# Altium project OpenBMS.PrjPcb (part 2 of 3)

## Sheet Measuring.SchDoc: Voltage Measurer
size 420 x 297 mm; ENG_APP_DATE: --/--/--; DSN_APP_DATE: --/--/--; CHK_APP_DATE: --/--/--; Revision: Cell Balancing
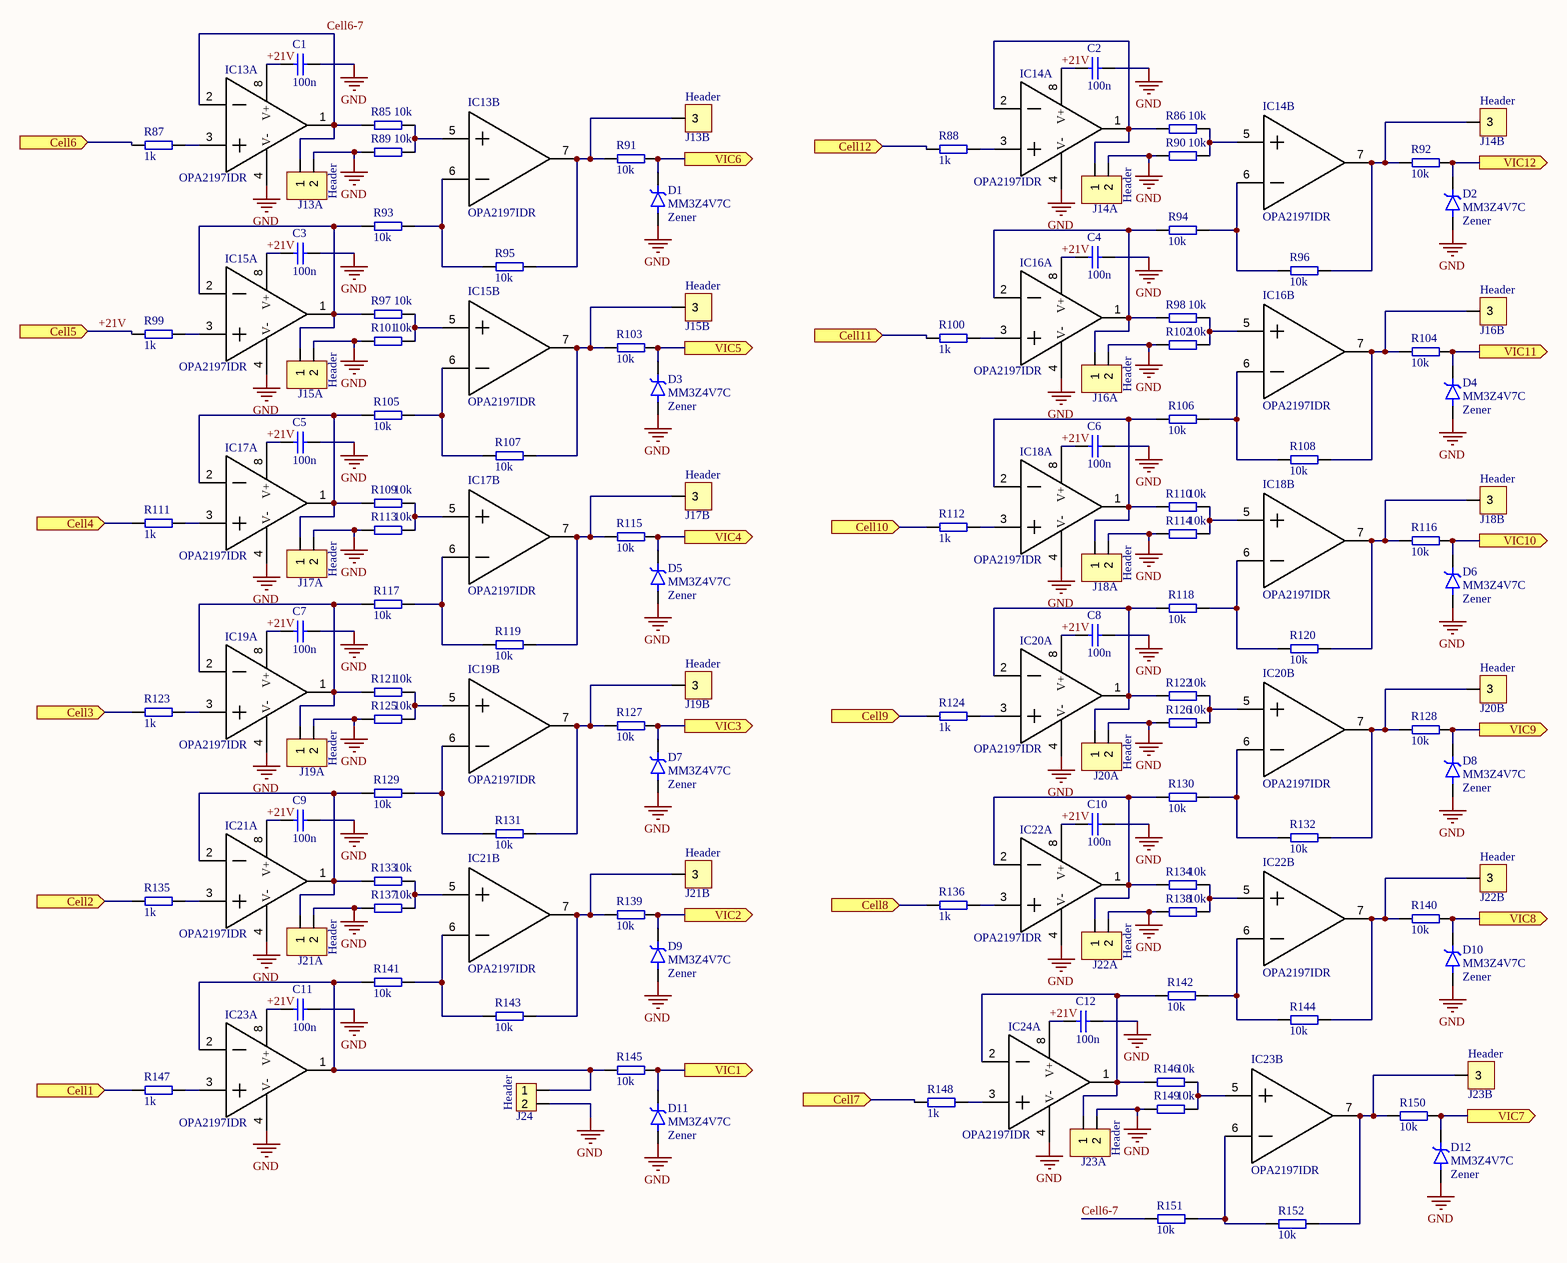
[diagram p2: Measuring.SchDoc]

### Parts
(Parts that share a designator on the sheet are numbered #1, #2 ... from top to bottom, then left to right.)
C1  Name: 100n  [C_0805]  (hidden comment: 100nF_35V)
C2  Name: 100n  [C_0805]  (hidden comment: 100nF_35V)
C3  Name: 100n  [C_0805]  (hidden comment: 100nF_35V)
C4  Name: 100n  [C_0805]  (hidden comment: 100nF_35V)
C5  Name: 100n  [C_0805]  (hidden comment: 100nF_35V)
C6#1  Name: 100n  [C_0805]  (hidden comment: 100nF_35V)
C7#1  Name: 100n  [C_0805]  (hidden comment: 100nF_35V)
C8  Name: 100n  [C_0805]  (hidden comment: 100nF_35V)
C9  Name: 100n  [C_0805]  (hidden comment: 100nF_35V)
C10  Name: 100n  [C_0805]  (hidden comment: 100nF_35V)
C11  Name: 100n  [C_0805]  (hidden comment: 100nF_35V)
C12  Name: 100n  [C_0805]  (hidden comment: 100nF_35V)
D1#1  value MM3Z4V7C  Type: Zener  [SODFL2512X90N]  (hidden comment: MM3Z4V7C_SOD-323F)
D2  value MM3Z4V7C  Type: Zener  [SODFL2512X90N]  (hidden comment: MM3Z4V7C_SOD-323F)
D3  value MM3Z4V7C  Type: Zener  [SODFL2512X90N]  (hidden comment: MM3Z4V7C_SOD-323F)
D4  value MM3Z4V7C  Type: Zener  [SODFL2512X90N]  (hidden comment: MM3Z4V7C_SOD-323F)
D5  value MM3Z4V7C  Type: Zener  [SODFL2512X90N]  (hidden comment: MM3Z4V7C_SOD-323F)
D6  value MM3Z4V7C  Type: Zener  [SODFL2512X90N]  (hidden comment: MM3Z4V7C_SOD-323F)
D7  value MM3Z4V7C  Type: Zener  [SODFL2512X90N]  (hidden comment: MM3Z4V7C_SOD-323F)
D8  value MM3Z4V7C  Type: Zener  [SODFL2512X90N]  (hidden comment: MM3Z4V7C_SOD-323F)
D9  value MM3Z4V7C  Type: Zener  [SODFL2512X90N]  (hidden comment: MM3Z4V7C_SOD-323F)
D10  value MM3Z4V7C  Type: Zener  [SODFL2512X90N]  (hidden comment: MM3Z4V7C_SOD-323F)
D11  value MM3Z4V7C  Type: Zener  [SODFL2512X90N]  (hidden comment: MM3Z4V7C_SOD-323F)
D12  value MM3Z4V7C  Type: Zener  [SODFL2512X90N]  (hidden comment: MM3Z4V7C_SOD-323F)
IC13  Manufacturer_Part_Number: OPA2197IDR  [SOIC8]  (hidden comment: OPA2197IDR_8-SOIC)  (parts A,B of 2)
IC14  Manufacturer_Part_Number: OPA2197IDR  [SOIC8]  (hidden comment: OPA2197IDR_8-SOIC)  (parts A,B of 2)
IC15  Manufacturer_Part_Number: OPA2197IDR  [SOIC8]  (hidden comment: OPA2197IDR_8-SOIC)  (parts A,B of 2)
IC16  Manufacturer_Part_Number: OPA2197IDR  [SOIC8]  (hidden comment: OPA2197IDR_8-SOIC)  (parts A,B of 2)
IC17  Manufacturer_Part_Number: OPA2197IDR  [SOIC8]  (hidden comment: OPA2197IDR_8-SOIC)  (parts A,B of 2)
IC18  Manufacturer_Part_Number: OPA2197IDR  [SOIC8]  (hidden comment: OPA2197IDR_8-SOIC)  (parts A,B of 2)
IC19  Manufacturer_Part_Number: OPA2197IDR  [SOIC8]  (hidden comment: OPA2197IDR_8-SOIC)  (parts A,B of 2)
IC20  Manufacturer_Part_Number: OPA2197IDR  [SOIC8]  (hidden comment: OPA2197IDR_8-SOIC)  (parts A,B of 2)
IC21  Manufacturer_Part_Number: OPA2197IDR  [SOIC8]  (hidden comment: OPA2197IDR_8-SOIC)  (parts A,B of 2)
IC22  Manufacturer_Part_Number: OPA2197IDR  [SOIC8]  (hidden comment: OPA2197IDR_8-SOIC)  (parts A,B of 2)
IC23  Manufacturer_Part_Number: OPA2197IDR  [SOIC8]  (hidden comment: OPA2197IDR_8-SOIC)  (parts A,B of 2)
IC24  Manufacturer_Part_Number: OPA2197IDR  [SOIC8]  (hidden comment: OPA2197IDR_8-SOIC)  (part A of 2)
J13#1  Name: Header  [HDR_1X3_2.54mm-MALE]  (hidden comment: 2.54mm pitch)  (parts A,B of 2)
J14  Name: Header  [HDR_1X3_2.54mm-MALE]  (hidden comment: 2.54mm pitch)  (parts A,B of 2)
J15#1  Name: Header  [HDR_1X3_2.54mm-MALE]  (hidden comment: 2.54mm pitch)  (parts A,B of 2)
J16#1  Name: Header  [HDR_1X3_2.54mm-MALE]  (hidden comment: 2.54mm pitch)  (parts A,B of 2)
J17  Name: Header  [HDR_1X3_2.54mm-MALE]  (hidden comment: 2.54mm pitch)  (parts A,B of 2)
J18  Name: Header  [HDR_1X3_2.54mm-MALE]  (hidden comment: 2.54mm pitch)  (parts A,B of 2)
J19  Name: Header  [HDR_1X3_2.54mm-MALE]  (hidden comment: 2.54mm pitch)  (parts A,B of 2)
J20  Name: Header  [HDR_1X3_2.54mm-MALE]  (hidden comment: 2.54mm pitch)  (parts A,B of 2)
J21  Name: Header  [HDR_1X3_2.54mm-MALE]  (hidden comment: 2.54mm pitch)  (parts A,B of 2)
J22  Name: Header  [HDR_1X3_2.54mm-MALE]  (hidden comment: 2.54mm pitch)  (parts A,B of 2)
J23  Name: Header  [HDR_1X3_2.54mm-MALE]  (hidden comment: 2.54mm pitch)  (parts A,B of 2)
J24  Name: Header  [HDR_1x2_2.54mm-MALE]  (hidden comment: 2.54mm pitch)
R85  Name: 10k  [R_0805]  (hidden comment: 10k_125mW)
R86  Name: 10k  [R_0805]  (hidden comment: 10k_125mW)
R87  Name: 1k  [R_0805]  (hidden comment: 1k_125mW)
R88  Name: 1k  [R_0805]  (hidden comment: 1k_125mW)
R89  Name: 10k  [R_0805]  (hidden comment: 10k_125mW)
R90  Name: 10k  [R_0805]  (hidden comment: 10k_125mW)
R91  Name: 10k  [R_0805]  (hidden comment: 10k_125mW)
R92  Name: 10k  [R_0805]  (hidden comment: 10k_125mW)
R93  Name: 10k  [R_0805]  (hidden comment: 10k_125mW)
R94  Name: 10k  [R_0805]  (hidden comment: 10k_125mW)
R95  Name: 10k  [R_0805]  (hidden comment: 10k_125mW)
R96  Name: 10k  [R_0805]  (hidden comment: 10k_125mW)
R97  Name: 10k  [R_0805]  (hidden comment: 10k_125mW)
R98  Name: 10k  [R_0805]  (hidden comment: 10k_125mW)
R99  Name: 1k  [R_0805]  (hidden comment: 1k_125mW)
R100  Name: 1k  [R_0805]  (hidden comment: 1k_125mW)
R101  Name: 10k  [R_0805]  (hidden comment: 10k_125mW)
R102  Name: 10k  [R_0805]  (hidden comment: 10k_125mW)
R103  Name: 10k  [R_0805]  (hidden comment: 10k_125mW)
R104  Name: 10k  [R_0805]  (hidden comment: 10k_125mW)
R105  Name: 10k  [R_0805]  (hidden comment: 10k_125mW)
R106  Name: 10k  [R_0805]  (hidden comment: 10k_125mW)
R107  Name: 10k  [R_0805]  (hidden comment: 10k_125mW)
R108  Name: 10k  [R_0805]  (hidden comment: 10k_125mW)
R109  Name: 10k  [R_0805]  (hidden comment: 10k_125mW)
R110  Name: 10k  [R_0805]  (hidden comment: 10k_125mW)
R111  Name: 1k  [R_0805]  (hidden comment: 1k_125mW)
R112  Name: 1k  [R_0805]  (hidden comment: 1k_125mW)
R113  Name: 10k  [R_0805]  (hidden comment: 10k_125mW)
R114  Name: 10k  [R_0805]  (hidden comment: 10k_125mW)
R115  Name: 10k  [R_0805]  (hidden comment: 10k_125mW)
R116  Name: 10k  [R_0805]  (hidden comment: 10k_125mW)
R117  Name: 10k  [R_0805]  (hidden comment: 10k_125mW)
R118  Name: 10k  [R_0805]  (hidden comment: 10k_125mW)
R119  Name: 10k  [R_0805]  (hidden comment: 10k_125mW)
R120  Name: 10k  [R_0805]  (hidden comment: 10k_125mW)
R121  Name: 10k  [R_0805]  (hidden comment: 10k_125mW)
R122  Name: 10k  [R_0805]  (hidden comment: 10k_125mW)
R123  Name: 1k  [R_0805]  (hidden comment: 1k_125mW)
R124  Name: 1k  [R_0805]  (hidden comment: 1k_125mW)
R125  Name: 10k  [R_0805]  (hidden comment: 10k_125mW)
R126  Name: 10k  [R_0805]  (hidden comment: 10k_125mW)
R127  Name: 10k  [R_0805]  (hidden comment: 10k_125mW)
R128  Name: 10k  [R_0805]  (hidden comment: 10k_125mW)
R129  Name: 10k  [R_0805]  (hidden comment: 10k_125mW)
R130  Name: 10k  [R_0805]  (hidden comment: 10k_125mW)
R131  Name: 10k  [R_0805]  (hidden comment: 10k_125mW)
R132  Name: 10k  [R_0805]  (hidden comment: 10k_125mW)
R133  Name: 10k  [R_0805]  (hidden comment: 10k_125mW)
R134  Name: 10k  [R_0805]  (hidden comment: 10k_125mW)
R135  Name: 1k  [R_0805]  (hidden comment: 1k_125mW)
R136  Name: 1k  [R_0805]  (hidden comment: 1k_125mW)
R137  Name: 10k  [R_0805]  (hidden comment: 10k_125mW)
R138  Name: 10k  [R_0805]  (hidden comment: 10k_125mW)
R139  Name: 10k  [R_0805]  (hidden comment: 10k_125mW)
R140  Name: 10k  [R_0805]  (hidden comment: 10k_125mW)
R141  Name: 10k  [R_0805]  (hidden comment: 10k_125mW)
R142  Name: 10k  [R_0805]  (hidden comment: 10k_125mW)
R143  Name: 10k  [R_0805]  (hidden comment: 10k_125mW)
R144  Name: 10k  [R_0805]  (hidden comment: 10k_125mW)
R145  Name: 10k  [R_0805]  (hidden comment: 10k_125mW)
R146  Name: 10k  [R_0805]  (hidden comment: 10k_125mW)
R147  Name: 1k  [R_0805]  (hidden comment: 1k_125mW)
R148  Name: 1k  [R_0805]  (hidden comment: 1k_125mW)
R149  Name: 10k  [R_0805]  (hidden comment: 10k_125mW)
R150  Name: 10k  [R_0805]  (hidden comment: 10k_125mW)
R151  Name: 10k  [R_0805]  (hidden comment: 10k_125mW)
R152  Name: 10k  [R_0805]  (hidden comment: 10k_125mW)

### Ports
Cell1 (in), Cell2 (in), Cell3 (in), Cell4 (in), Cell5 (in), Cell6 (in), Cell7 (in), Cell8 (in), Cell9 (in), Cell10 (in), Cell11 (in), Cell12 (in), VIC1 (out), VIC2 (out), VIC3 (out), VIC4 (out), VIC5 (out), VIC6 (out), VIC7 (out), VIC8 (out), VIC9 (out), VIC10 (out), VIC11 (out), VIC12 (out)

### Nets
GND: C1.1 C2.1 C3.1 C4.1 C5.1 C6#1.1 C7#1.1 C8.1 C9.1 C10.1 C11.1 C12.1 D1#1.A D2.A D3.A D4.A D5.A D6.A D7.A D8.A D9.A D10.A D11.A D12.A IC13.4(V-) IC14.4(V-) IC15.4(V-) IC16.4(V-) IC17.4(V-) IC18.4(V-) IC19.4(V-) IC20.4(V-) IC21.4(V-) IC22.4(V-) IC23.4(V-) IC24.4(V-) J13#1.2 J14.2 J15#1.2 J16#1.2 J17.2 J18.2 J19.2 J20.2 J21.2 J22.2 J23.2 J24.2 R89.2 R90.2 R101.2 R102.2 R113.2 R114.2 R125.2 R126.2 R137.2 R138.2 R149.2
+21V: C1.2 C2.2 C3.2 C4.2 C5.2 C6#1.2 C7#1.2 C8.2 C9.2 C10.2 C11.2 C12.2 IC13.8(V+) IC14.8(V+) IC15.8(V+) IC16.8(V+) IC17.8(V+) IC18.8(V+) IC19.8(V+) IC20.8(V+) IC21.8(V+) IC22.8(V+) IC23.8(V+) IC24.8(V+) R99.2 ; port Cell5
Cell6-7: IC13.1(OUT_A) IC13.2(-IN_A) J13#1.1 R85.2 R151.2
NetD1#1_K: D1#1.K R91.1 ; port VIC6
NetD2_K: D2.K R92.1 ; port VIC12
NetD3_K: D3.K R103.1 ; port VIC5
NetD4_K: D4.K R104.1 ; port VIC11
NetD5_K: D5.K R115.1 ; port VIC4
NetD6_K: D6.K R116.1 ; port VIC10
NetD7_K: D7.K R127.1 ; port VIC3
NetD8_K: D8.K R128.1 ; port VIC9
NetD9_K: D9.K R139.1 ; port VIC2
NetD10_K: D10.K R140.1 ; port VIC8
NetD11_K: D11.K R145.1 ; port VIC1
NetD12_K: D12.K R150.1 ; port VIC7
NetIC13_3: IC13.3(+IN_A) R87.1
NetIC13_5: IC13.5(+IN_B) R85.1 R89.1
NetIC13_6: IC13.6(-IN_B) R93.1 R95.2
NetIC13_7: IC13.7(OUT_B) J13#1.3 R91.2 R95.1
NetIC14_1: IC14.1(OUT_A) IC14.2(-IN_A) J14.1 R86.2
NetIC14_3: IC14.3(+IN_A) R88.1
NetIC14_5: IC14.5(+IN_B) R86.1 R90.1
NetIC14_6: IC14.6(-IN_B) R94.1 R96.2
NetIC14_7: IC14.7(OUT_B) J14.3 R92.2 R96.1
NetIC15_1: IC15.1(OUT_A) IC15.2(-IN_A) J15#1.1 R93.2 R97.2
NetIC15_3: IC15.3(+IN_A) R99.1
NetIC15_5: IC15.5(+IN_B) R97.1 R101.1
NetIC15_6: IC15.6(-IN_B) R105.1 R107.2
NetIC15_7: IC15.7(OUT_B) J15#1.3 R103.2 R107.1
NetIC16_1: IC16.1(OUT_A) IC16.2(-IN_A) J16#1.1 R94.2 R98.2
NetIC16_3: IC16.3(+IN_A) R100.1
NetIC16_5: IC16.5(+IN_B) R98.1 R102.1
NetIC16_6: IC16.6(-IN_B) R106.1 R108.2
NetIC16_7: IC16.7(OUT_B) J16#1.3 R104.2 R108.1
NetIC17_1: IC17.1(OUT_A) IC17.2(-IN_A) J17.1 R105.2 R109.2
NetIC17_3: IC17.3(+IN_A) R111.1
NetIC17_5: IC17.5(+IN_B) R109.1 R113.1
NetIC17_6: IC17.6(-IN_B) R117.1 R119.2
NetIC17_7: IC17.7(OUT_B) J17.3 R115.2 R119.1
NetIC18_1: IC18.1(OUT_A) IC18.2(-IN_A) J18.1 R106.2 R110.2
NetIC18_3: IC18.3(+IN_A) R112.1
NetIC18_5: IC18.5(+IN_B) R110.1 R114.1
NetIC18_6: IC18.6(-IN_B) R118.1 R120.2
NetIC18_7: IC18.7(OUT_B) J18.3 R116.2 R120.1
NetIC19_1: IC19.1(OUT_A) IC19.2(-IN_A) J19.1 R117.2 R121.2
NetIC19_3: IC19.3(+IN_A) R123.1
NetIC19_5: IC19.5(+IN_B) R121.1 R125.1
NetIC19_6: IC19.6(-IN_B) R129.1 R131.2
NetIC19_7: IC19.7(OUT_B) J19.3 R127.2 R131.1
NetIC20_1: IC20.1(OUT_A) IC20.2(-IN_A) J20.1 R118.2 R122.2
NetIC20_3: IC20.3(+IN_A) R124.1
NetIC20_5: IC20.5(+IN_B) R122.1 R126.1
NetIC20_6: IC20.6(-IN_B) R130.1 R132.2
NetIC20_7: IC20.7(OUT_B) J20.3 R128.2 R132.1
NetIC21_1: IC21.1(OUT_A) IC21.2(-IN_A) J21.1 R129.2 R133.2
NetIC21_3: IC21.3(+IN_A) R135.1
NetIC21_5: IC21.5(+IN_B) R133.1 R137.1
NetIC21_6: IC21.6(-IN_B) R141.1 R143.2
NetIC21_7: IC21.7(OUT_B) J21.3 R139.2 R143.1
NetIC22_1: IC22.1(OUT_A) IC22.2(-IN_A) J22.1 R130.2 R134.2
NetIC22_3: IC22.3(+IN_A) R136.1
NetIC22_5: IC22.5(+IN_B) R134.1 R138.1
NetIC22_6: IC22.6(-IN_B) R142.1 R144.2
NetIC22_7: IC22.7(OUT_B) J22.3 R140.2 R144.1
NetIC23_1: IC23.1(OUT_A) IC23.2(-IN_A) J24.1 R141.2 R145.2
NetIC23_3: IC23.3(+IN_A) R147.1
NetIC23_5: IC23.5(+IN_B) R146.1 R149.1
NetIC23_6: IC23.6(-IN_B) R151.1 R152.2
NetIC23_7: IC23.7(OUT_B) J23.3 R150.2 R152.1
NetIC24_1: IC24.1(OUT_A) IC24.2(-IN_A) J23.1 R142.2 R146.2
NetIC24_3: IC24.3(+IN_A) R148.1
NetP?_1: R147.2 ; port Cell1
NetP?_2: R136.2 ; port Cell8
NetP?_3: R135.2 ; port Cell2
NetP?_4: R124.2 ; port Cell9
NetP?_5: R123.2 ; port Cell3
NetP?_6: R112.2 ; port Cell10
NetP?_7: R111.2 ; port Cell4
NetP?_8: R100.2 ; port Cell11
NetP?_10: R88.2 ; port Cell12
NetP?_11: R87.2 ; port Cell6
NetP?_13: R148.2 ; port Cell7

### Notes on the sheet
- THIS DOCUMENT AND THE DATA DISCLOSED HEREIN OR
- HEREWITH IS THE PROPERTY OF ALTIUM LIMITED AND MAY
- DWG NO:
- REVISION
- REV:
- DESCRIPTION
- DATE
- APPROVED
- BE FREELY DISTRIBUTED IN WHOLE. NO RIGHTS ARE
- RESERVED OR EXPRESS OR IMPLIED WARANTEE GIVEN.
- ENG:
- APPROVALS
- PROJECT
- DSN:
- CHK:
- REFERENCE DOCUMENTS
- PROJECT REVISION:
- TITLE
- DOCUMENT REVISION:
- DESIGN ITEM:
- BOM:
- FAB DWG:
- PCB DWG:
- ASSY DWG:
- SCALE:
- A3
- SIZE
- CAGE CODE
- FILE NAME
- DWG NO.
- SHEET
- OF
- REV

### Library data of the parts
C1-C5 C6#1 C7#1 C8-C12 = C_100nF_0805: Capacitor [SMD]; Manufacturer: Murata; Manufacturer Part Number: GCJ21BL81H104KA01L; Capacitance: 100nF; Tolerance: 10%; Voltage Rating: 50V; ComponentLink1Description: DATASHEET; ComponentLink1URL: https://hr.mouser.com/datasheet/2/281/GCJ21BL81H104KA01_01-1963909.pdf; ComponentLink2Description: BUY; ComponentLink2URL: https://hr.mouser.com/ProductDetail/Murata-Electronics/GCJ21BL81H104KA01L?qs=QzBtWTOodeX5ICEuC%252Bh33g%3D%3D; Supplier 1: Mouser; Supplier Part Number 1: 81-GCJ21BL81H104KA1L; Case Code (Imperial): 0805; Case Code (Metric): 2012; Case/Package: 0805; Features: Soft Termination; Max Operating Temperature: 150°C; Min Operating Temperature: -55°C; Mount: Surface Mount; Packaging: Tape and Reel; Ratings: AEC-Q200; RoHS Compliant: Yes; Supplier Packaging 1: Tape & Reel; Supplier Unit Price 1: $0.30; Supplier Location 1: US
D1#1 D2-D12 = MM3Z4V7C_SOD-323F: Zener Single Diode, 4.7 V, 200 mW [SMD]; Manufacturer: ON Semiconductor / Fairchild; MP: 1N4148WS; MF: ON Semiconductor; Forward Voltage: 1V; Impedance: 75R; Max Power Dissipation: 200mW; Max Reverse Current: 2.7uA; Test Current: 5mA; Tolerance: 5%; Working Voltage: 4.7V; Price: None; SnapEDA_Link: https://www.snapeda.com/parts/1N4148WS/ON%20Semiconductor/view-part/2747266/?ref=snap; Availability: Good; Package: SOD-323FL-2 ON Semiconductor; ComponentLink1Description: DATASHEET; ComponentLink1URL: https://hr.mouser.com/datasheet/2/308/1/MM3Z9V1C_D-2315854.pdf; ComponentLink2Description: BUY; ComponentLink2URL: https://hr.mouser.com/ProductDetail/onsemi-Fairchild/MM3Z4V7C?qs=sGAEpiMZZMtdo5lL%2F%252BX2BwKAOpX0rFyD; Check_prices: https://www.snapeda.com/parts/1N4148WS/ON%20Semiconductor/view-part/2747266/?ref=eda; Purchase-URL: https://pricing.snapeda.com/search/part/1N4148WS/?ref=eda; Supplier 1: Mouser; Supplier Part Number 1: 512-MM3Z4V7C; Element Configuration: Single; Height: 1mm; Lead Free: Lead Free; Length: 1.3mm; Max Operating Temperature: 150°C; Max Reverse Leakage Current: 2.7uA; Min Operating Temperature: -65°C; Mount: Surface Mount; Number of Pins: 2; Package Quantity: 1; Packaging: Tape and Reel; Power Dissipation: 200mW; Radiation Hardening: No; RoHS Compliant: Yes; Voltage Tolerance: 5%; Weight: 0.0276g; Width: 1.7mm; Zener Voltage: 4.7V; Supplier Packaging 1: Tape & Reel; Supplier Unit Price 1: $0.24; Supplier Location 1: US; Manufacturer Part Number: MM3Z4V7C; Case/Package: SOD−323FL
IC13-IC24 = OPA2197IDR_8-SOIC: Dual OP AMP [TH]; Manufacturer_Name: Texas Instruments; Bandwidth: 10MHz; Input Bias Current: 5pA; Input Offset Voltage (Vos): 250uV; Number of Amplifiers: 2; Operating Supply Current: 1mA; Output Current per Channel: 65mA; Slew Rate: 20V/µs; Datasheet Link: https://componentsearchengine.com/Datasheets/2/OPA2197IDR.pdf; Height: 1.75mm; Mouser Part Number: 595-OPA2197IDR; Mouser Price/Stock: https://www.mouser.com/Search/Refine.aspx?Keyword=595-OPA2197IDR; ComponentLink1Description: DATASHEET; ComponentLink1URL: https://www.ti.com/lit/ds/symlink/opa2197.pdf?HQS=dis-mous-null-mousermode-dsf-pf-null-wwe&ts=1646121857740&ref_url=https%253A%252F%252Fwww.mouser.de%252F; ComponentLink2Description: BUY; ComponentLink2URL: https://hr.mouser.com/ProductDetail/Texas-Instruments/OPA2197IDR?qs=LuYMPh7GGMTV7Fo%252BZRgbTw%3D%3D; Supplier 1: Mouser; Supplier Part Number 1: 595-OPA2197IDR; Case/Package: SOIC-8; Gain Bandwidth Product: 10MHz; Lead Free: Lead Free; Max Operating Temperature: 125°C; Min Operating Temperature: -40°C; Mount: Surface Mount; Number of Channels: 2; Number of Circuits: 2; Number of Pins: 8; Packaging: Cut Tape; REACH SVHC: No SVHC; RoHS Compliant: Yes; Supplier Packaging 1: Tape & Reel; Supplier Unit Price 1: $2.72; Supplier Location 1: US; Manufacturer: Texas Instruments; Manufacturer Part Number: OPA2197IDR
J13#1 J14 J15#1 J16#1 J17-J23 = Header 1x3AB: Header, 3-Pin [TH]; Manufacturer: Molex; Connector Type: Male Pin; Current Rating: 4A; Gender: Male; Glow Wire Compliant: Non-compliant; Number of Circuits: 15; Pitch: 0.1inch; Voltage Rating: 250V; LatestRevisionDate: 17-Jul-2002; LatestRevisionNote: Re-released for DXP Platform.; Publisher: Altium Limited; ComponentLink1Description: DATASHEET; ComponentLink1URL: https://hr.mouser.com/datasheet/2/276/0022284150_PCB_HEADERS-159054.pdf; ComponentLink2Description: BUY; ComponentLink2URL: https://hr.mouser.com/ProductDetail/Molex/22-28-4150?qs=M5Ic86%252BuP8aClMFgmZrq7g%3D%3D; Supplier 1: Mouser; Supplier Part Number 1: 538-22-28-4150; Color: Black; Contact Material: Brass; Contact Mating Length: 0.24inch; Contact Plating: Tin; Contact Type: Male Pin; Flammability Rating: UL94 V-0; Height: 2.29mm; Housing Color: Black; Housing Material: Thermoplastic; Lead Free: Contains Lead; Length: 38.1mm; Mount: Through Hole; Number of Contacts: 15; Number of Positions: 15; Number of Rows: 1; Orientation: Vertical; Package Quantity: 1; Packaging: Bulk; RoHS Compliant: Yes; Series: KK® 42375; Termination: Solder; Voltage Rating (DC): 250V; Width: 2.49mm; Supplier Packaging 1: Bulk; Supplier Unit Price 1: $0.57; Supplier Location 1: US; Manufacturer Part Number: 22-28-4150
J24 = Header 1x2: Header, 2-Pin [TH]; Manufacturer: Molex; Current Rating: 4A; Gender: Male; Glow Wire Compliant: Non-compliant; Number of Circuits: 15; Pitch: 0.1inch; Voltage Rating: 250V; Connector Type: Male Pin; LatestRevisionDate: 17-Jul-2002; LatestRevisionNote: Re-released for DXP Platform.; Publisher: Altium Limited; ComponentLink1Description: DATASHEET; ComponentLink1URL: https://hr.mouser.com/datasheet/2/276/0022284150_PCB_HEADERS-159054.pdf; ComponentLink2Description: BUY; ComponentLink2URL: https://hr.mouser.com/ProductDetail/Molex/22-28-4150?qs=M5Ic86%252BuP8aClMFgmZrq7g%3D%3D; Supplier 1: Mouser; Supplier Part Number 1: 538-22-28-4150; Color: Black; Contact Material: Brass; Contact Mating Length: 0.24inch; Contact Plating: Tin; Contact Type: Male Pin; Flammability Rating: UL94 V-0; Height: 2.29mm; Housing Color: Black; Housing Material: Thermoplastic; Lead Free: Contains Lead; Length: 38.1mm; Mount: Through Hole; Number of Contacts: 15; Number of Positions: 15; Number of Rows: 1; Orientation: Vertical; Package Quantity: 1; Packaging: Bulk; RoHS Compliant: Yes; Series: KK® 42375; Termination: Solder; Voltage Rating (DC): 250V; Width: 2.49mm; Supplier Packaging 1: Bulk; Supplier Unit Price 1: $0.57; Supplier Location 1: US; Manufacturer Part Number: 22-28-4150
R85 R86 R89-R98 R101-R110 R113-R122 R125-R134 R137-R146 R149-R152 = R_10k_0805: Resistor [SMD]; Manufacturer: Vishay; Manufacturer Part Number: CRCW080510K0FKEAC; Power Rating: 125mW; Resistance: 10000R; Tolerance: 1%; ComponentLink1Description: DATASHEET; ComponentLink1URL: https://hr.mouser.com/datasheet/2/427/crcwce3-1762584.pdf; ComponentLink2Description: BUY; ComponentLink2URL: https://hr.mouser.com/ProductDetail/Vishay-Dale/CRCW080510K0FKEAC?qs=E3Y5ESvWgWORadmUijPtxQ%3D%3D; Supplier 1: Mouser; Supplier Part Number 1: 71-CRCW080510K0FKEAC; Case/Package: 0805; Lead Free: Lead Free; RoHS Compliant: Yes; Supplier Packaging 1: Tape & Reel; Supplier Unit Price 1: $0.10; Supplier Location 1: US
R87 R88 R99 R100 R111 R112 R123 R124 R135 R136 R147 R148 = R_1k_0805: Resistor [SMD]; Manufacturer: Vishay; Manufacturer Part Number: CRCW08051K00FKEAC; Max Power Dissipation: 125mW; Resistance: 1kR; Temperature Coefficient: 100ppm/°C; Tolerance: 1%; Voltage Rating: 150V; ComponentLink1Description: DATASHEET; ComponentLink1URL: https://www.mouser.com/datasheet/2/427/crcwce3-1762584.pdf; ComponentLink2Description: BUY; ComponentLink2URL: https://www.mouser.com/ProductDetail/Vishay-Dale/CRCW08051K00FKEAC?qs=CZ6xfwOSLTXmQIgaYvN%2FBA%3D%3D; Supplier 1: Mouser; Supplier Part Number 1: 71-CRCW08051K00FKEAC; Case Code (Imperial): 0805; Case Code (Metric): 2012; Case/Package: 0805; Contact Plating: Tin; Features: Automotive AEC-Q200,Anti-Sulfur; Height: 0.02inch; Length: 2mm; Max Operating Temperature: 155°C; Min Operating Temperature: -55°C; Number of Terminations: 2; Package Quantity: 5000; Packaging: Tape and Reel; Power Rating: 125mW; Radiation Hardening: No; Resistor Type: Thick Film; RoHS Compliant: Yes; Series: RCA; Termination: Wraparound; Width: 0.049inch; Supplier Packaging 1: Tape & Reel; Supplier Unit Price 1: $0.12; Supplier Location 1: US; Lead Free: Lead Free; Mount: Surface Mount

## Sheet Microcontroller.SchDoc: MCU & Power management
size 420 x 297 mm; ENG_APP_DATE: --/--/--; DSN_APP_DATE: --/--/--; CHK_APP_DATE: --/--/--
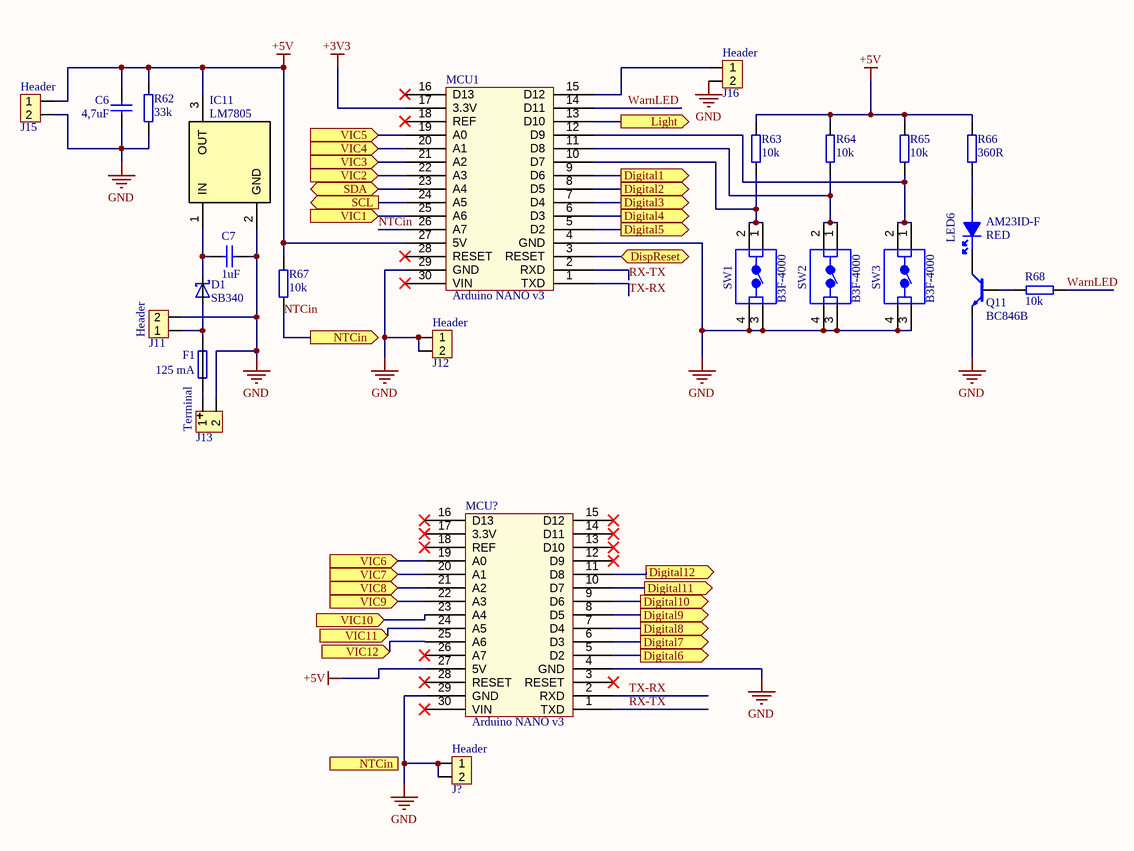
[diagram p3: Microcontroller.SchDoc]

### Parts
(Parts that share a designator on the sheet are numbered #1, #2 ... from top to bottom, then left to right.)
C6#2  Name: 4,7uF  [C_0805]  (hidden comment: 4,7uF_35V)
C7#2  Name: 1uF  [C_0805]  (hidden comment: 1uF_35V)
D1#2  Name: SB340  [DO-201AD]  (hidden comment: SB340_DO-201AD)
F1  value 125 mA  [FUSE_5x20]  (hidden comment: PTF0078P)
IC11#2  Name: LM7805  [TO220]  (hidden comment: LM7805_TO220)
J11#2  Name: Header  [HDR_1x2_2.54mm-MALE]  (hidden comment: 2.54mm pitch)
J12#2  Name: Header  [HDR_1x2_2.54mm-MALE]  (hidden comment: 2.54mm pitch)
J13#2  Name: Terminal  [TERMINAL_90_5MM]  (hidden comment: 5mm pitch)
J15#2  Name: Header  [HDR_1x2_2.54mm-MALE]  (hidden comment: 2.54mm pitch)
J16#2  Name: Header  [HDR_1x2_2.54mm-MALE]  (hidden comment: 2.54mm pitch)
J?  Name: Header  [HDR_1x2_2.54mm-MALE]  (hidden comment: 2.54mm pitch)
LED6#2  Name: RED  Manufacturer Part Number: AM23ID-F  [LED_SOT23]  (hidden comment: LED_SOT23)
MCU1  Name: Arduino NANO v3  [Arduino_Nano_V3.0]  (hidden comment: Arduino NANO v 3.0)
MCU?  Name: Arduino NANO v3  [Arduino_Nano_V3.0]  (hidden comment: Arduino NANO v 3.0)
Q11#2  Name: BC846B  [NPN_BJT_SOT23]  (hidden comment: BC846B_SOT23)
R62#2  Name: 33k  [R_0805]  (hidden comment: 33k_125mW)
R63#2  Name: 10k  [R_0805]  (hidden comment: 10k_125mW)
R64#2  Name: 10k  [R_0805]  (hidden comment: 10k_125mW)
R65#2  Name: 10k  [R_0805]  (hidden comment: 10k_125mW)
R66#2  Name: 360R  [R_0805]  (hidden comment: 360R_125mW)
R67#2  Name: 10k  [R_0805]  (hidden comment: 10k_125mW)
R68#2  Name: 10k  [R_0805]  (hidden comment: 10k_125mW)
SW1  B3F-4000  [PUSH_BUTTON]
SW2  B3F-4000  [PUSH_BUTTON]
SW3  B3F-4000  [PUSH_BUTTON]

### Ports
Digital1 (out), Digital2 (out), Digital3 (out), Digital4 (out), Digital5 (out), Digital6 (out), Digital7 (out), Digital8 (out), Digital9 (out), Digital10 (out), Digital11 (out), Digital12 (out), DispReset (bidir), Light (out), NTCin (out), SCL (out), SDA (bidir), VIC1 (in), VIC2 (in), VIC3 (in), VIC4 (in), VIC5 (in), VIC6 (in), VIC7 (in), VIC8 (in), VIC9 (in), VIC10 (in), VIC11 (in), VIC12 (in)

### Nets
+3V3: MCU1.17(3.3V)
+5V: C6#2.2 IC11#2.3(OUT) J15#2.1 MCU1.27(5V) MCU?.27(5V) R62#2.1 R63#2.2 R64#2.2 R65#2.2 R66#2.1 R67#2.1
GND: C6#2.1 C7#2.2 IC11#2.2(GND) J11#2.2 J12#2.1 J12#2.2 J13#2.2 J15#2.2 J16#2.2 J?.1 J?.2 MCU1.4(GND) MCU1.29(GND) MCU?.4(GND) MCU?.29(GND) Q11#2.3(E) R62#2.2 SW1.3 SW1.4 SW2.3 SW2.4 SW3.3 SW3.4
NTCin: MCU1.26(A7) R67#2.2 ; port NTCin
RX-TX: MCU1.2(RXD) MCU?.1(TXD)
TX-RX: MCU1.1(TXD) MCU?.2(RXD)
WarnLED: MCU1.14(D11) R68#2.1
NetC7#2_1: C7#2.1 D1#2.2 IC11#2.1(IN)
NetD1#2_1: D1#2.1 F1.2 J11#2.1
NetDS1_1: MCU1.3(RESET) ; port DispReset
NetDS1_2: MCU1.24(A5) ; port SCL
NetDS1_3: MCU1.23(A4) ; port SDA
NetF1_1: F1.1 J13#2.1
NetJ16#2_1: J16#2.1 MCU1.15(D12)
NetLED6#2_1: LED6#2.1(A) R66#2.2
NetLED6#2_3: LED6#2.3(K) Q11#2.1(C)
NetMCU1_5: MCU1.5(D2) ; port Digital5
NetMCU1_6: MCU1.6(D3) ; port Digital4
NetMCU1_7: MCU1.7(D4) ; port Digital3
NetMCU1_8: MCU1.8(D5) ; port Digital2
NetMCU1_9: MCU1.9(D6) ; port Digital1
NetMCU1_10: MCU1.10(D7) R63#2.1 SW1.1 SW1.2
NetMCU1_11: MCU1.11(D8) R64#2.1 SW2.1 SW2.2
NetMCU1_12: MCU1.12(D9) R65#2.1 SW3.1 SW3.2
NetMCU1_13: MCU1.13(D10) ; port Light
NetMCU1_19: MCU1.19(A0) ; port VIC5
NetMCU1_20: MCU1.20(A1) ; port VIC4
NetMCU1_21: MCU1.21(A2) ; port VIC3
NetMCU1_22: MCU1.22(A3) ; port VIC2
NetMCU1_25: MCU1.25(A6) ; port VIC1
NetMCU?_5: MCU?.5(D2) ; port Digital6
NetMCU?_6: MCU?.6(D3) ; port Digital7
NetMCU?_7: MCU?.7(D4) ; port Digital8
NetMCU?_8: MCU?.8(D5) ; port Digital9
NetMCU?_9: MCU?.9(D6) ; port Digital10
NetMCU?_10: MCU?.10(D7) ; port Digital11
NetMCU?_11: MCU?.11(D8) ; port Digital12
NetMCU?_19: MCU?.19(A0) ; port VIC6
NetMCU?_20: MCU?.20(A1) ; port VIC7
NetMCU?_21: MCU?.21(A2) ; port VIC8
NetMCU?_22: MCU?.22(A3) ; port VIC9
NetMCU?_23: MCU?.23(A4) ; port VIC10
NetMCU?_24: MCU?.24(A5) ; port VIC11
NetMCU?_25: MCU?.25(A6) ; port VIC12
NetQ11#2_2: Q11#2.2(B) R68#2.2

Not connected (* = marked no-connect by the designer): MCU1 16(D13)* 18(REF)* 28(RESET)* 30(VIN)*; MCU? 3(RESET)* 12(D9)* 13(D10)* 14(D11)* 15(D12)* 16(D13)* 17(3.3V)* 18(REF)* 26(A7)* 28(RESET)* 30(VIN)*

### Notes on the sheet
- THIS DOCUMENT AND THE DATA DISCLOSED HEREIN OR
- HEREWITH IS THE PROPERTY OF ALTIUM LIMITED AND MAY
- DWG NO:
- REVISION
- REV:
- DESCRIPTION
- DATE
- APPROVED
- BE FREELY DISTRIBUTED IN WHOLE. NO RIGHTS ARE
- RESERVED OR EXPRESS OR IMPLIED WARANTEE GIVEN.
- ENG:
- APPROVALS
- PROJECT
- DSN:
- CHK:
- REFERENCE DOCUMENTS
- PROJECT REVISION:
- TITLE
- DOCUMENT REVISION:
- DESIGN ITEM:
- BOM:
- FAB DWG:
- PCB DWG:
- ASSY DWG:
- SCALE:
- A3
- SIZE
- CAGE CODE
- FILE NAME
- DWG NO.
- SHEET
- OF
- REV

### Library data of the parts
C6#2 = C_4,7uF_0805: Capacitor [SMD]; Manufacturer: Murata; Manufacturer Part Number: GRM21BR61H475KE51L; Capacitance: 4.7uF; Dielectric: X5R; Material: Ceramic; Tolerance: 10%; Voltage Rating: 50V; ComponentLink1Description: DATASHEET; ComponentLink1URL: https://hr.mouser.com/datasheet/2/281/1/GRM21BR61H475KE51_01A-1987025.pdf; ComponentLink2Description: BUY; ComponentLink2URL: https://hr.mouser.com/ProductDetail/Murata-Electronics/GRM21BR61H475KE51L?qs=eeBpzGFlv%252B%252BOtLzDC1PY6Q%3D%3D; Supplier 1: Mouser; Supplier Part Number 1: 81-GRM21BR61H475KE1L; Case Code (Imperial): 0805; Case Code (Metric): 2012; Case/Package: 0805; Depth: 1.25mm; Height: 1.25mm; Lead Free: Lead Free; Length: 2mm; Max Operating Temperature: 85°C; Min Operating Temperature: -55°C; Mount: Surface Mount; Packaging: Tape and Reel; REACH SVHC: No SVHC; RoHS Compliant: Yes; Thickness: 0.055inch; Voltage Rating (DC): 50V; Width: 0.049inch; Supplier Packaging 1: Tape & Reel; Supplier Unit Price 1: $0.35; Supplier Location 1: US
C7#2 = C_1uF_0805: Capacitor [SMD]; Manufacturer: Murata; Manufacturer Part Number: GCJ21BR71H105KA01L; Dielectric: X7R; Tolerance: 10%; Voltage Rating: 50V; ComponentLink1Description: DATASHEET; ComponentLink1URL: https://hr.mouser.com/datasheet/2/281/GCJ21BR71H105KA01_01-1963894.pdf; ComponentLink2Description: BUY; ComponentLink2URL: https://hr.mouser.com/ProductDetail/Murata-Electronics/GCJ21BR71H105KA01L?qs=hNud%2FORuBR3CJcLH9kX5%252Bw%3D%3D; Supplier 1: Mouser; Supplier Part Number 1: 81-GCJ21BR71H105KA1L; Capacitance: 1uF; Case Code (Imperial): 0805; Case Code (Metric): 2012; Case/Package: 0805; Features: Soft Termination; Height: 1.25mm; Lead Free: Lead Free; Length: 0.079inch; Max Operating Temperature: 125°C; Min Operating Temperature: -55°C; Mount: Surface Mount; Package Quantity: 3000; Packaging: Tape and Reel; Ratings: AEC-Q200; RoHS Compliant: Yes; Termination: SMD/SMT; Thickness: 0.057inch; Voltage Rating (DC): 50V; Weight: 0.000335oz; Width: 0.049inch; Supplier Packaging 1: Tape & Reel; Supplier Unit Price 1: $0.32; Supplier Location 1: US
D1#2 = SB340_DO-201AD: Diode Schottky 40V 3A [TH]; Manufacturer: Vishay Semiconductors; Manufacturer Part Number: SB340-E3/54; MP: 1N5822; Value: SB340; MF: ON Semiconductor; Element Configuration: Single; Forward Voltage: 490mV; Max Forward Surge Current (Ifsm): 120A; Max Reverse Current: 500uA; Package: DO-201AD-201 Panjit; SnapEDA_Link: https://www.snapeda.com/parts/1N5822/ON%20Semiconductor/view-part/1356736/?ref=snap; Price: None; Availability: Unavailable; ComponentLink1Description: DATASHEET; ComponentLink1URL: https://hr.mouser.com/datasheet/2/427/VISH_S_A0001809294_1-2567748.pdf; ComponentLink2Description: BUY; ComponentLink2URL: https://hr.mouser.com/ProductDetail/Vishay-General-Semiconductor/SB340-E3-54?qs=u91jd7aysvMt27Sml4hAKw%3D%3D; Supplier 1: Mouser; Supplier Part Number 1: 625-SB340-E3/54; Average Rectified Current: 3A; Case/Package: DO-201AD; Forward Current: 3A; Height: 5.8mm; Lead Free: Lead Free; Length: 10mm; Max Operating Temperature: 125°C; Max Repetitive Reverse Voltage (Vrrm): 40V; Max Reverse Leakage Current: 500uA; Max Reverse Voltage (DC): 40V; Max Surge Current: 120A; Min Operating Temperature: -65°C; Mount: Through Hole; Number of Pins: 2; Package Quantity: 1400; Packaging: Tape and Reel; Peak Non-Repetitive Surge Current: 120A; Radiation Hardening: No; REACH SVHC: Unknown; RoHS Compliant: Yes; Series: -; Width: 5.8mm; Supplier Packaging 1: Tape & Reel; Supplier Unit Price 1: $0.46; Supplier Location 1: US
F1 = PTF0078P: Fuse holder [TH]; Manufacturer: Littelfuse; Manufacturer Part Number: 0PTF0078P; MP: 4527; MF: Keystone; Name: Fuse 1A; Number of Circuits: 1; Price: None; Availability: Unavailable; SnapEDA_Link: https://www.snapeda.com/parts/4527/Keystone%20Electronics/view-part/475964/?ref=snap; Package: None; ComponentLink1Description: DATASHEET; ComponentLink1URL: https://hr.mouser.com/datasheet/2/240/Littelfuse-2891966.pdf; ComponentLink2Description: BUY; ComponentLink2URL: https://hr.mouser.com/ProductDetail/Littelfuse/0PTF0078P?qs=Co4VkB5J4%2Fsczy6gG8s%2FsA%3D%3D; Supplier 1: Mouser; Supplier Part Number 1: 576-0PTF0078P; Mount: PCB; Package Quantity: 2000; Packaging: Bulk; Termination: PC Pin; Supplier Packaging 1: Bulk; Supplier Unit Price 1: $0.59; Supplier Location 1: US
IC11#2 = LM7805_TO220: Linear Voltage Regulator 5V [TH] with thermal pad mounted to Fischer elektronik SK09 - 20mm heatsink with a screw and nut; Manufacturer: STMicroelectronics; Manufacturer Part Number: L7805C-V; MP: LM7805CT; MF: ON Semiconductor; Dropout Voltage: 2V; Max Input Voltage: 35V; Max Output Current: 1.5A; Min Input Voltage: 7V; Number of Outputs: 1; Output Configuration: Positive; Output Type: Fixed; Power Supply Rejection Ratio (PSRR): 62dB; Quiescent Current: 8mA; Tolerance: 5%; SnapEDA_Link: https://www.snapeda.com/parts/LM7805CT/ON%20Semiconductor/view-part/546231/?ref=snap; Price: None; Package: TO-220 ON Semiconductor; Value: *; Availability: Unavailable; ComponentLink1Description: Rregulator_DATASHEET; ComponentLink1URL: https://hr.mouser.com/datasheet/2/389/cd00000444-1795274.pdf; ComponentLink2Description: Regulator_BUY; ComponentLink2URL: https://hr.mouser.com/ProductDetail/STMicroelectronics/L7805CV?qs=9NrABl3fj%2FqplZAHiYUxWg%3D%3D; Supplier 1: Mouser; Supplier Part Number 1: 511-L7805CV; Case/Package: TO-220; Contact Plating: Gold; Height: 9.15mm; Lead Free: Lead Free; Length: 10.4mm; Max Operating Temperature: 125°C; Min Operating Temperature: 0°C; Min Output Voltage: 5V; Mount: Through Hole; Nominal Output Voltage: 5V; Number of Pins: 3; Number of Regulators: 1; Output Current: 1.5A; Output Voltage: 5V; Package Quantity: 1000; Packaging: Rail/Tube; Polarity: Positive; Radiation Hardening: No; REACH SVHC: No SVHC; RoHS Compliant: Yes; Series: -; Weight: 0.08113oz; Width: 4.6mm; Supplier Packaging 1: Tube; Supplier Unit Price 1: $0.63; Supplier Location 1: US; ComponentLink3Description: Heatsink_OFFICIAL PAGE; ComponentLink3URL: https://www.fischerelektronik.de/web_fischer/en_GB/heatsinks/A01/Standard%20extruded%20heatsinks/PG/SK09/search.xhtml; ComponentLink4Description: Heatsink_BUY; ComponentLink4URL: https://www.tme.eu/en/details/sk09-20sa220/heatsinks/fischer-elektronik/sk-09-20-sa-to-220/
J11#2 J12#2 J15#2 J16#2 J? = Header 1x2: as J24 on sheet Measuring; LatestRevisionDate: 17-Jul-2002; LatestRevisionNote: Re-released for DXP Platform.; Publisher: Altium Limited; ComponentLink1Description: DATASHEET; ComponentLink1URL: https://hr.mouser.com/datasheet/2/276/0022284150_PCB_HEADERS-159054.pdf; ComponentLink2Description: BUY; ComponentLink2URL: https://hr.mouser.com/ProductDetail/Molex/22-28-4150?qs=M5Ic86%252BuP8aClMFgmZrq7g%3D%3D; Supplier 1: Mouser; Supplier Part Number 1: 538-22-28-4150; Color: Black; Contact Material: Brass; Contact Mating Length: 0.24inch; Contact Plating: Tin; Contact Type: Male Pin; Flammability Rating: UL94 V-0; Height: 2.29mm; Housing Color: Black; Housing Material: Thermoplastic; Lead Free: Contains Lead; Length: 38.1mm; Mount: Through Hole; Number of Contacts: 15; Number of Positions: 15; Number of Rows: 1; Orientation: Vertical; Package Quantity: 1; Packaging: Bulk; RoHS Compliant: Yes; Series: KK® 42375; Termination: Solder; Voltage Rating (DC): 250V; Width: 2.49mm; Supplier Packaging 1: Bulk; Supplier Unit Price 1: $0.57; Supplier Location 1: US; Manufacturer Part Number: 22-28-4150
J13#2 = Terminal 1x2: PCB connector, 2-Pin [TH]; Manufacturer: CUI Devices; Manufacturer Part Number: TB006-508-02BE; LatestRevisionDate: 17-Jul-2002; LatestRevisionNote: Re-released for DXP Platform.; Publisher: Altium Limited; ComponentLink1Description: DATASHEET; ComponentLink1URL: https://hr.mouser.com/datasheet/2/670/tb006_508-2306877.pdf; ComponentLink2Description: BUY; ComponentLink2URL: https://hr.mouser.com/ProductDetail/CUI-Devices/TB006-508-02BE?qs=vLWxofP3U2wEdOVV%2FaT04w%3D%3D; Supplier 1: Mouser; Supplier Part Number 1: 490-TB006-508-02BE; Supplier Unit Price 1: $0.85; Supplier Location 1: US
LED6#2 = LED_SOT23: Red LED [SMD]; Manufacturer: Kingbright; Dominant Wavelength: 617nm; Forward Current: 20mA; Forward Voltage: 2V; Lens Style: Diffused,Tinted; Lens Transparency: Diffused; Luminous Intensity: 7mcd; Power Rating: 75mW; Viewing Angle: 140°; Wavelength: 625nm; ComponentLink1Description: DATASHEET; ComponentLink1URL: https://hr.mouser.com/datasheet/2/216/AM23ID-F-33364.pdf; ComponentLink2Description: BUY; ComponentLink2URL: https://hr.mouser.com/ProductDetail/Kingbright/AM23ID-F?qs=y3UkhjaxUTbVf8YFp%2FiekA%3D%3D; Supplier 1: Mouser; Supplier Part Number 1: 604-AM23ID-F; Case/Package: SOT-23; Color: Red; Height: 1.2mm; Illumination Color: Red; Lead Free: Lead Free; Length: 3mm; Lens Color: Red; Max Operating Temperature: 85°C; Min Operating Temperature: -40°C; Mount: Surface Mount; Package Quantity: 2000; Packaging: Tape and Reel; RoHS Compliant: Yes; Series: -; Test Current: 20mA; Width: 1.3mm; Supplier Packaging 1: Tape & Reel; Supplier Unit Price 1: $0.50; Supplier Location 1: US
MCU1 MCU? = Arduino NANO v 3.0: Microcontroller [TH]; Manufacturer Part Number: A000005; Core Architecture: AVR; Data Bus Width: 8b; Evaluation Kit: Yes; Number of Bits: 8; Operating Supply Voltage: 20V; Interface: I2C,SPI,USB; ComponentLink1Description: OFFICIAL PAGE; ComponentLink1URL: https://store.arduino.cc/arduino-nano; Height: 0.25inch; Length: 7inch; Package Quantity: 1; Packaging: Bulk; REACH SVHC: No SVHC; Weight: 0.02lb; Width: 5inch; Manufacturer: Arduino; ComponentLink2Description: BUY; ComponentLink2URL: https://www.mouser.com/ProductDetail/Arduino/A000005?qs=FN83AlR%252Bkj%252B2HN65G4WOuA%3D%3D; Supplier 1: Mouser; Supplier Part Number 1: 782-A000005
Q11#2 = BC846B_SOT23: NPN transistor [SMD]; Manufacturer Part Number: BC846ALT1G; Manufacturer: ON Semiconductor; Collector Base Voltage (VCBO): 80V; Collector Emitter Breakdown Voltage: 65V; Collector Emitter Saturation Voltage: 600mV; Current Rating: 100mA; Element Configuration: Single; Emitter Base Voltage (VEBO): 6V; Frequency: 100MHz; hFE Min: 110; Max Power Dissipation: 300mW; Number of Elements: 1; ComponentLink1Description: DATASHEET; ComponentLink1URL: https://hr.mouser.com/datasheet/2/308/1/BC846ALT1_D-2310268.pdf; ComponentLink2Description: BUY; ComponentLink2URL: https://hr.mouser.com/ProductDetail/onsemi/BC846ALT1G?qs=vNc2DXHODiKaYXYnVvJi5w%3D%3D; Case/Package: SOT-23; Collector Emitter Voltage (VCEO): 65V; Collector-emitter Voltage-Max: 600mV; Contact Plating: Tin,Matte; Gain Bandwidth Product: 100MHz; Halogen Free: Halogen Free; Height: 0.94mm; Lead Free: Lead Free; Length: 2.9mm; Max Breakdown Voltage: 65V; Max Collector Current: 100mA; Max Frequency: 100MHz; Max Operating Temperature: 150°C; Min Operating Temperature: -55°C; Number of Pins: 3; Package Quantity: 1; Packaging: Tape and Reel; Polarity: NPN; Power Dissipation: 300mW; Radiation Hardening: No; REACH SVHC: No SVHC; RoHS Compliant: Yes; Series: BC846AL; Transition Frequency: 100MHz; Voltage Rating (DC): 65V; Width: 1.3mm; Supplier 1: Mouser; Supplier Part Number 1: 863-BC846ALT1G
R62#2 = R_33k_0805: Resistor [SMD]; Manufacturer: Vishay Dale; Manufacturer Part Number: CRCW080533K0FKEBC; Max Power Dissipation: 125mW; Resistance: 33kR; Temperature Coefficient: 100ppm/°C; Tolerance: 1%; ComponentLink1Description: DATASHEET; ComponentLink1URL: https://hr.mouser.com/datasheet/2/427/crcwce3-1762584.pdf; ComponentLink2Description: BUY; ComponentLink2URL: https://hr.mouser.com/ProductDetail/Vishay-Dale/CRCW080533K0FKEBC?qs=wd5RIQLrsJg6GD4hLX9MMA%3D%3D; Supplier 1: Mouser; Supplier Part Number 1: 71-CRCW080533K0FKEBC; Case/Package: 0805; Max Operating Temperature: 155°C; Min Operating Temperature: -55°C; Number of Terminations: 2; Packaging: Tape and Reel; Resistor Type: Thick Film; RoHS Compliant: Yes; Supplier Packaging 1: Tape & Reel; Supplier Unit Price 1: $0.16; Supplier Location 1: US
R63#2 R64#2 R65#2 R67#2 R68#2 = R_10k_0805: as R85 on sheet Measuring; ComponentLink1Description: DATASHEET; ComponentLink1URL: https://hr.mouser.com/datasheet/2/427/crcwce3-1762584.pdf; ComponentLink2Description: BUY; ComponentLink2URL: https://hr.mouser.com/ProductDetail/Vishay-Dale/CRCW080510K0FKEAC?qs=E3Y5ESvWgWORadmUijPtxQ%3D%3D; Supplier 1: Mouser; Supplier Part Number 1: 71-CRCW080510K0FKEAC; Case/Package: 0805; Lead Free: Lead Free; RoHS Compliant: Yes; Supplier Packaging 1: Tape & Reel; Supplier Unit Price 1: $0.10; Supplier Location 1: US
R66#2 = R_360R_0805: Resistor [SMD]; Manufacturer: Vishay; Manufacturer Part Number: CRCW0805360RFKEA; Max Power Dissipation: 125mW; Number of Terminals/Pins: 2; Temperature Coefficient: 100ppm/°C; Tolerance: 1%; Voltage Rating: 150V; ComponentLink1Description: DATASHEET; ComponentLink1URL: https://hr.mouser.com/datasheet/2/427/dcrcwe3-1762152.pdf; ComponentLink2Description: BUY; ComponentLink2URL: https://hr.mouser.com/ProductDetail/Vishay-Dale/CRCW0805360RFKEA?qs=ofC1ORbyWJdnf1jRDhIDIw%3D%3D; Supplier 1: Mouser; Supplier Part Number 1: 71-CRCW0805360RFKEA; Case Code (Imperial): 0805; Case Code (Metric): 2012; Case/Package: 0805; Contact Plating: Tin; Depth: 1.25mm; Features: Automotive AEC-Q200; Height: 0.45mm; Lead Free: Lead Free; Length: 2mm; Max Operating Temperature: 155°C; Military Standard: Not; Min Operating Temperature: -55°C; Number of Pins: 2; Number of Terminations: 2; Package Quantity: 5000; Packaging: Cut Tape; Power Rating: 125mW; Radiation Hardening: No; REACH SVHC: Unknown; Resistance: 360R; Resistor Type: Thick Film; RoHS Compliant: Yes; Series: D/CRCW E3; Technology: THICK FILM; Termination: SMD/SMT; Voltage Rating (DC): 150V; Weight: 0.000194oz; Width: 1.25mm; Supplier Packaging 1: Tape & Reel; Supplier Unit Price 1: $0.12; Supplier Location 1: US
SW1-SW3 = B3F-4000: SPST Push button [TH]; Manufacturer: Omron; MF: TE Connectivity; MP: 3-1825910-1; Actuator Color: Blue; Actuator Length: 0.8mm; Actuator Type: Standard; Contact Current Rating: 50mA; Contact Resistance: 100mR; Electrical Life: 3000000Cycles; Illumination Type: Non-Illuminated,Illuminated; Max Voltage Rating (DC): 24V; Number of Poles: 1; Operating Force: 1.27N; Switch Function: Off-Mom; Switch Travel: 0.3mm; Availability: Unavailable; SnapEDA_Link: https://www.snapeda.com/parts/3-1825910-1/TE%20Connectivity%20ALCOSWITCH%20Switches/view-part/452461/?ref=snap; Price: None; EU_RoHS_Compliance: Compliant; Package: None; TE_purchase_URL: https://www.te.com/usa-en/product-3-1825910-1.html?te_bu=Cor&te_type=disp&te_campaign=seda_glo_cor-seda-global-disp-prtnr-fy19-seda-model-bom-cta_sma-317_1&elqCampaignId=32493; Value: *; Name: B3F-4000; ComponentLink1Description: DATASHEET; ComponentLink1URL: https://hr.mouser.com/datasheet/2/307/en-b3f-13826.pdf; ComponentLink2Description: BUY; ComponentLink2URL: https://hr.mouser.com/ProductDetail/Omron-Electronics/B3F-4000?qs=sGAEpiMZZMv0NwlthflBi3MjD%252BFGR0mw; Supplier 1: Mouser; Supplier Part Number 1: 653-B3F-4000; Contact Material: Gold,Silver; Contact Plating: Silver,Gold; Contact Type: 1 maker; Current Rating: 50mA; Depth: 12mm; Height: 4.3mm; Insulation Resistance: 100MR; Lead Free: Lead Free; Length: 12mm; Max Current Rating: 50mA; Max Operating Temperature: 70°C; Mechanical Life: 3000000Cycles; Min Operating Temperature: -25°C; Mount: Through Hole,PCB; Orientation: Straight; Package Quantity: 500; Packaging: Bulk; REACH SVHC: Unknown; RoHS Compliant: Yes; Series: B3F; Termination: PC Pins; Throw Configuration: SPST; Voltage Rating (DC): 24V; Weight: 0.85g; Width: 12mm; Supplier Packaging 1: Bulk; Supplier Unit Price 1: $0.54; Supplier Location 1: US; Manufacturer Part Number: B3F-4000

## Sheet Display.SchDoc: LCD Display
size 420 x 297 mm; ENG_APP_DATE: --/--/--; DSN_APP_DATE: --/--/--; CHK_APP_DATE: --/--/--
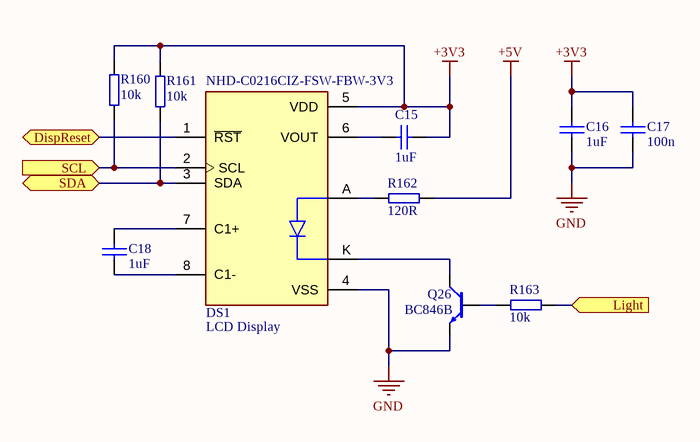
[diagram p4: Display.SchDoc]

### Parts
C15  Name: 1uF  [C_0603]  (hidden comment: 1uF_35V)
C16  Name: 1uF  [C_0805]  (hidden comment: 1uF_35V)
C17  Name: 100n  [C_0805]  (hidden comment: 100nF_35V)
C18  Name: 1uF  [C_0603]  (hidden comment: 1uF_35V)
DS1  MP: NHD-C0216CIZ-FSW-FBW-3V3  Name: LCD Display  [LCD_NHD-C0216CIZ-FSW-FBW-3V3]  (hidden comment: LCD_FSTN_Display)
Q26  Name: BC846B  [NPN_BJT_SOT23]  (hidden comment: BC846B_SOT23)
R160  Name: 10k  [R_0805]  (hidden comment: 10k_125mW)
R161  Name: 10k  [R_0805]  (hidden comment: 10k_125mW)
R162  Name: 120R  [R_0805]  (hidden comment: 120R_125mW)
R163  Name: 10k  [R_0805]  (hidden comment: 10k_125mW)

### Ports
DispReset (bidir), Light (in), SCL (in), SDA (bidir)

### Nets
+3V3: C15.2 C16.2 C17.2 DS1.5(VDD) R160.1 R161.1
+5V: R162.1
GND: C16.1 C17.1 DS1.4(VSS) Q26.3(E)
NetC15_1: C15.1 DS1.6(VOUT)
NetC18_1: C18.1 DS1.8(C1-)
NetC18_2: C18.2 DS1.7(C1+)
NetDS1_1: DS1.1(~{RST}) ; port DispReset
NetDS1_2: DS1.2(SCL) R160.2 ; port SCL
NetDS1_3: DS1.3(SDA) R161.2 ; port SDA
NetDS1_A: DS1.A R162.2
NetDS1_K: DS1.K Q26.1(C)
NetMCU1_13: R163.1 ; port Light
NetQ26_2: Q26.2(B) R163.2

### Notes on the sheet
- THIS DOCUMENT AND THE DATA DISCLOSED HEREIN OR
- HEREWITH IS THE PROPERTY OF ALTIUM LIMITED AND MAY
- DWG NO:
- REVISION
- REV:
- DESCRIPTION
- DATE
- APPROVED
- BE FREELY DISTRIBUTED IN WHOLE. NO RIGHTS ARE
- RESERVED OR EXPRESS OR IMPLIED WARANTEE GIVEN.
- ENG:
- APPROVALS
- PROJECT
- DSN:
- CHK:
- REFERENCE DOCUMENTS
- PROJECT REVISION:
- TITLE
- DOCUMENT REVISION:
- DESIGN ITEM:
- BOM:
- FAB DWG:
- PCB DWG:
- ASSY DWG:
- SCALE:
- A3
- SIZE
- CAGE CODE
- FILE NAME
- DWG NO.
- SHEET
- OF
- REV

### Library data of the parts
C15 C18 = C_1uF_0603: Capacitor [SMD]; Manufacturer: Murata; Manufacturer Part Number: GRT188R61H105KE13D; Dielectric: X5R; Tolerance: 10%; Voltage Rating: 50V; ComponentLink1Description: DATASHEET; ComponentLink1URL: https://hr.mouser.com/datasheet/2/281/1/GRT188R61H105KE13_01-1989463.pdf; ComponentLink2Description: BUY; ComponentLink2URL: https://hr.mouser.com/ProductDetail/Murata-Electronics/GRT188R61H105KE13D?qs=drgMNd%252BkGPNIxxtJByMGCg%3D%3D; Capacitance: 1uF; Case Code (Imperial): 0603; Case Code (Metric): 1608; Case/Package: 0603; Length: 0.063inch; Max Operating Temperature: 85°C; Min Operating Temperature: -55°C; Mount: Surface Mount; Packaging: Tape and Reel; Ratings: AEC-Q200; RoHS Compliant: Yes; Thickness: 0.035inch; Voltage Rating (DC): 50V; Width: 0.031inch; Supplier 1: Mouser; Supplier Part Number 1: 81-GRT188R61H105KE3D
C16 = C_1uF_0805: as C7#2 on sheet Microcontroller; ComponentLink1Description: DATASHEET; ComponentLink1URL: https://hr.mouser.com/datasheet/2/281/GCJ21BR71H105KA01_01-1963894.pdf; ComponentLink2Description: BUY; ComponentLink2URL: https://hr.mouser.com/ProductDetail/Murata-Electronics/GCJ21BR71H105KA01L?qs=hNud%2FORuBR3CJcLH9kX5%252Bw%3D%3D; Supplier 1: Mouser; Supplier Part Number 1: 81-GCJ21BR71H105KA1L; Capacitance: 1uF; Case Code (Imperial): 0805; Case Code (Metric): 2012; Case/Package: 0805; Features: Soft Termination; Height: 1.25mm; Lead Free: Lead Free; Length: 0.079inch; Max Operating Temperature: 125°C; Min Operating Temperature: -55°C; Mount: Surface Mount; Package Quantity: 3000; Packaging: Tape and Reel; Ratings: AEC-Q200; RoHS Compliant: Yes; Termination: SMD/SMT; Thickness: 0.057inch; Voltage Rating (DC): 50V; Weight: 0.000335oz; Width: 0.049inch; Supplier Packaging 1: Tape & Reel; Supplier Unit Price 1: $0.32; Supplier Location 1: US
C17 = C_100nF_0805: as C1 on sheet Measuring; ComponentLink1Description: DATASHEET; ComponentLink1URL: https://hr.mouser.com/datasheet/2/281/GCJ21BL81H104KA01_01-1963909.pdf; ComponentLink2Description: BUY; ComponentLink2URL: https://hr.mouser.com/ProductDetail/Murata-Electronics/GCJ21BL81H104KA01L?qs=QzBtWTOodeX5ICEuC%252Bh33g%3D%3D; Supplier 1: Mouser; Supplier Part Number 1: 81-GCJ21BL81H104KA1L; Case Code (Imperial): 0805; Case Code (Metric): 2012; Case/Package: 0805; Features: Soft Termination; Max Operating Temperature: 150°C; Min Operating Temperature: -55°C; Mount: Surface Mount; Packaging: Tape and Reel; Ratings: AEC-Q200; RoHS Compliant: Yes; Supplier Packaging 1: Tape & Reel; Supplier Unit Price 1: $0.30; Supplier Location 1: US
DS1 = LCD_FSTN_Display: NHD-C0216CIZ-FSW-FBW-3V3 / LCD Display; Manufacturer: Newhaven Display; MF: Newhaven; Background Color: White; Backlight Type: LED; Contrast Ratio: 6:1; Interface: I2C; Number of Characters: 32; Operating Supply Voltage: 3V; SnapEDA_Link: https://www.snapeda.com/parts/NHD-C0216CIZ-FSW-FBW-3V3/Newhaven%20Display%20Intl/view-part/1660867/?ref=snap; Value: *; Digi-Key_Part_Number: NHD-C0216CIZ-FSW-FBW-3V3-ND; Digi-Key_Purchase_URL: https://www.digikey.com/product-detail/en/newhaven-display-intl/NHD-C0216CIZ-FSW-FBW-3V3/NHD-C0216CIZ-FSW-FBW-3V3-ND/2165872?utm_source=snapeda&utm_medium=aggregator&utm_campaign=symbol; Package: None; ComponentLink1Description: DATASHEET; ComponentLink1URL: https://hr.mouser.com/datasheet/2/291/NHD_C0216CiZ_FSW_FBW_3V3-2904729.pdf; ComponentLink2Description: BUY; ComponentLink2URL: https://hr.mouser.com/ProductDetail/Newhaven-Display/NHD-C0216CiZ-FSW-FBW-3V3?qs=Vb5qD4CGh4kMzks2c1g3mA%3D%3D; Supplier 1: Mouser; Supplier Part Number 1: 763-C0216CIZFSWFBW3V; Max Operating Temperature: 70°C; Min Operating Temperature: -20°C; Mount: Through Hole; Number of Pins: 8; Package Quantity: 100; Packaging: Bulk; Supplier Packaging 1: Bulk; Supplier Unit Price 1: $16.00; Supplier Location 1: US; Manufacturer Part Number: NHD-C0216CIZ-FSW-FBW-3V3
Q26 = BC846B_SOT23: as Q11#2 on sheet Microcontroller; ComponentLink1Description: DATASHEET; ComponentLink1URL: https://hr.mouser.com/datasheet/2/308/1/BC846ALT1_D-2310268.pdf; ComponentLink2Description: BUY; ComponentLink2URL: https://hr.mouser.com/ProductDetail/onsemi/BC846ALT1G?qs=vNc2DXHODiKaYXYnVvJi5w%3D%3D; Case/Package: SOT-23; Collector Emitter Voltage (VCEO): 65V; Collector-emitter Voltage-Max: 600mV; Contact Plating: Tin,Matte; Gain Bandwidth Product: 100MHz; Halogen Free: Halogen Free; Height: 0.94mm; Lead Free: Lead Free; Length: 2.9mm; Max Breakdown Voltage: 65V; Max Collector Current: 100mA; Max Frequency: 100MHz; Max Operating Temperature: 150°C; Min Operating Temperature: -55°C; Number of Pins: 3; Package Quantity: 1; Packaging: Tape and Reel; Polarity: NPN; Power Dissipation: 300mW; Radiation Hardening: No; REACH SVHC: No SVHC; RoHS Compliant: Yes; Series: BC846AL; Transition Frequency: 100MHz; Voltage Rating (DC): 65V; Width: 1.3mm; Supplier 1: Mouser; Supplier Part Number 1: 863-BC846ALT1G
R160 R161 R163 = R_10k_0805: as R85 on sheet Measuring; ComponentLink1Description: DATASHEET; ComponentLink1URL: https://hr.mouser.com/datasheet/2/427/crcwce3-1762584.pdf; ComponentLink2Description: BUY; ComponentLink2URL: https://hr.mouser.com/ProductDetail/Vishay-Dale/CRCW080510K0FKEAC?qs=E3Y5ESvWgWORadmUijPtxQ%3D%3D; Supplier 1: Mouser; Supplier Part Number 1: 71-CRCW080510K0FKEAC; Case/Package: 0805; Lead Free: Lead Free; RoHS Compliant: Yes; Supplier Packaging 1: Tape & Reel; Supplier Unit Price 1: $0.10; Supplier Location 1: US
R162 = R_120R_0805: Resistor [SMD]; Manufacturer: Vishay; Manufacturer Part Number: CRCW0805120RFKEAC; Max Power Dissipation: 125mW; Temperature Coefficient: 100ppm/°C; Tolerance: 1%; ComponentLink1Description: DATASHEET; ComponentLink1URL: https://hr.mouser.com/datasheet/2/427/crcwce3-1762584.pdf; ComponentLink2Description: BUY; ComponentLink2URL: https://hr.mouser.com/ProductDetail/Vishay-Dale/CRCW0805120RFKEAC?qs=sGAEpiMZZMtlubZbdhIBIIZe04wfiaJWafdARitYaZA%3D; Supplier 1: Mouser; Supplier Part Number 1: 71-CRCW0805120RFKEAC; Case/Package: 0805; Max Operating Temperature: 155°C; Min Operating Temperature: -55°C; Number of Terminations: 2; Packaging: Tape and Reel; Resistance: 120R; Resistor Type: Thick Film; RoHS Compliant: Yes; Supplier Packaging 1: Tape & Reel; Supplier Unit Price 1: $0.12; Supplier Location 1: US